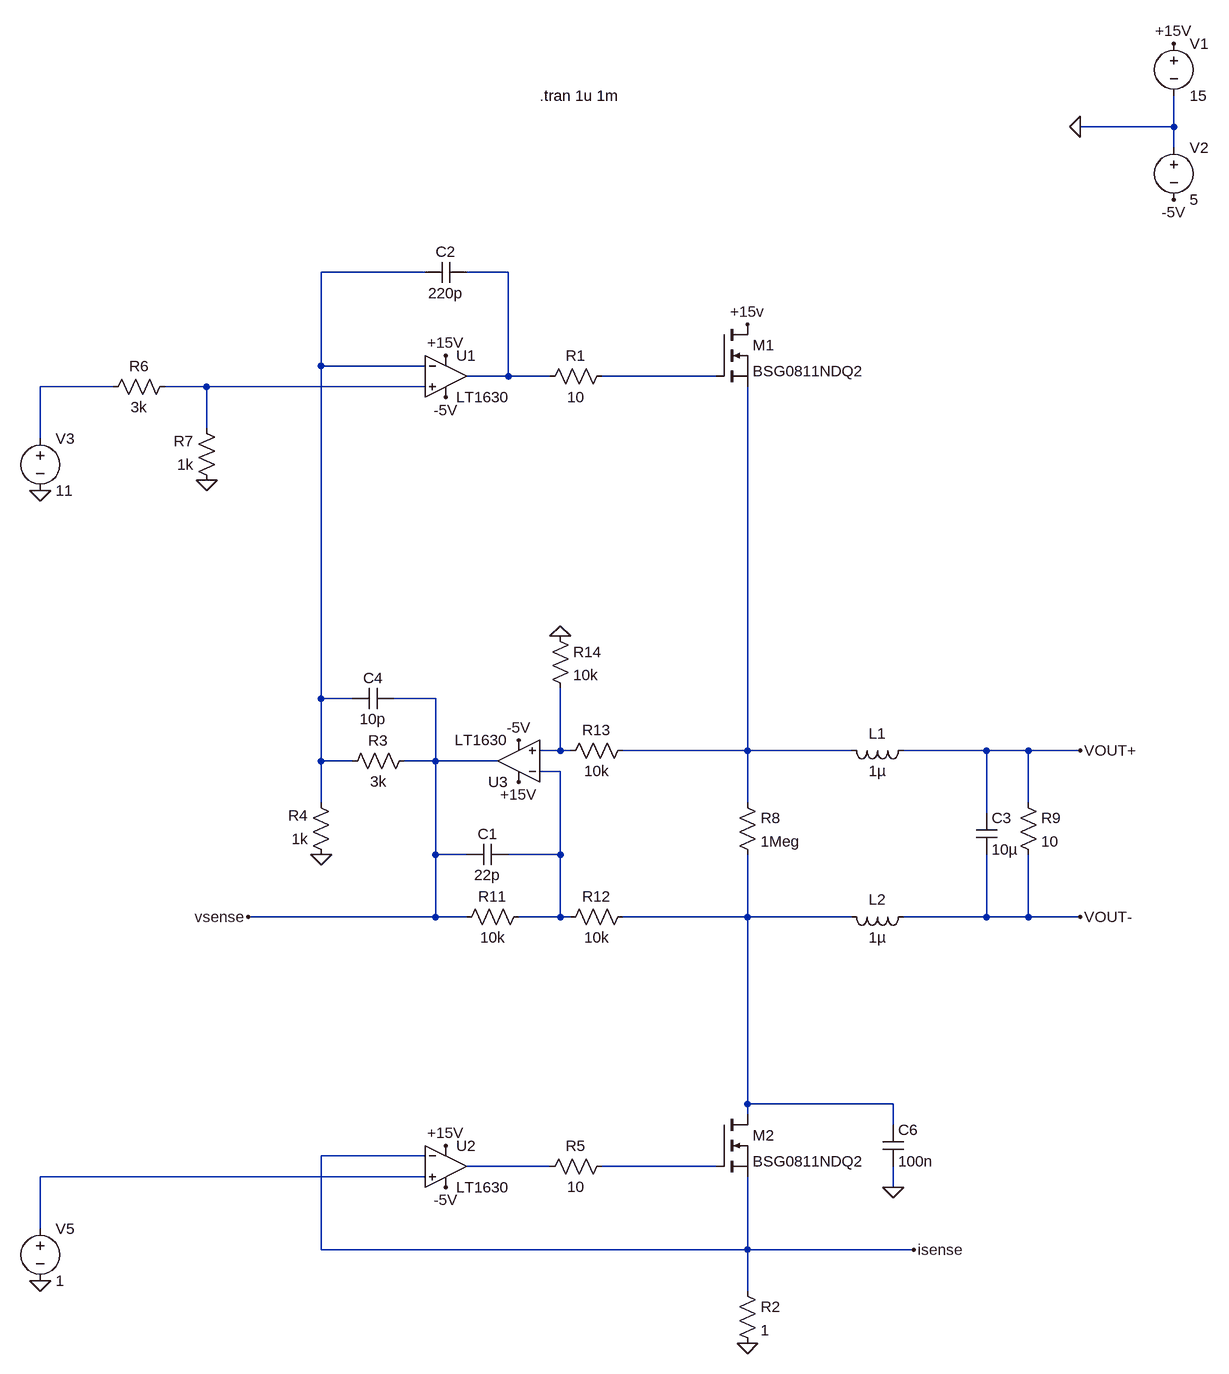
[diagram p0: schematic sim.asc]
sim.asc, the LTspice schematic file:
Version 4
SHEET 1 2592 2176
WIRE 1456 -688 1456 -736
WIRE 1456 -688 1312 -688
WIRE 1456 -656 1456 -688
WIRE 304 -464 144 -464
WIRE 432 -464 368 -464
WIRE 144 -320 144 -464
WIRE 304 -320 144 -320
WIRE 432 -304 432 -464
WIRE 432 -304 368 -304
WIRE 496 -304 432 -304
WIRE 752 -304 576 -304
WIRE -176 -288 -288 -288
WIRE -32 -288 -96 -288
WIRE 304 -288 -32 -288
WIRE -32 -224 -32 -288
WIRE -288 -208 -288 -288
WIRE 144 192 144 -320
WIRE 192 192 144 192
WIRE 320 192 256 192
WIRE 512 272 512 176
WIRE 512 272 480 272
WIRE 528 272 512 272
WIRE 800 272 800 -288
WIRE 800 272 608 272
WIRE 960 272 800 272
WIRE 1168 272 1040 272
WIRE 1232 272 1168 272
WIRE 1312 272 1232 272
WIRE 144 288 144 192
WIRE 192 288 144 288
WIRE 320 288 320 192
WIRE 320 288 272 288
WIRE 416 288 320 288
WIRE 512 304 480 304
WIRE 144 352 144 288
WIRE 800 352 800 272
WIRE 1232 352 1232 272
WIRE 1168 368 1168 272
WIRE 320 432 320 288
WIRE 368 432 320 432
WIRE 512 432 512 304
WIRE 512 432 432 432
WIRE 320 528 320 432
WIRE 320 528 32 528
WIRE 368 528 320 528
WIRE 512 528 512 432
WIRE 512 528 448 528
WIRE 528 528 512 528
WIRE 800 528 800 432
WIRE 800 528 608 528
WIRE 960 528 800 528
WIRE 1168 528 1168 432
WIRE 1168 528 1040 528
WIRE 1232 528 1232 432
WIRE 1232 528 1168 528
WIRE 1312 528 1232 528
WIRE 800 816 800 528
WIRE 1024 816 800 816
WIRE 800 832 800 816
WIRE 1024 848 1024 816
WIRE 304 896 144 896
WIRE 496 912 368 912
WIRE 752 912 576 912
WIRE 304 928 -288 928
WIRE 1024 944 1024 912
WIRE -288 1008 -288 928
WIRE 144 1040 144 896
WIRE 800 1040 800 928
WIRE 800 1040 144 1040
WIRE 1056 1040 800 1040
WIRE 800 1104 800 1040
FLAG 1456 -816 +15V
FLAG 1456 -576 -5V
FLAG 1312 -688 0
FLAG 1312 272 VOUT+
FLAG 1312 528 VOUT-
FLAG 448 256 -5V
FLAG 448 320 +15V
FLAG 512 96 0
FLAG 336 -272 -5V
FLAG 336 -336 +15V
FLAG 800 -384 +15v
FLAG -288 -128 0
FLAG 144 432 0
FLAG 336 944 -5V
FLAG 336 880 +15V
FLAG -288 1088 0
FLAG 800 1184 0
FLAG 1024 944 0
FLAG -32 -144 0
FLAG 1056 1040 isense
FLAG 32 528 vsense
SYMBOL voltage 1456 -832 R0
SYMATTR InstName V1
SYMATTR Value 15
SYMBOL voltage 1456 -672 R0
SYMATTR InstName V2
SYMATTR Value 5
SYMBOL res 1216 336 R0
SYMATTR InstName R9
SYMATTR Value 10
SYMBOL res 464 512 R90
WINDOW 0 0 56 VBottom 2
WINDOW 3 32 56 VTop 2
SYMATTR InstName R11
SYMATTR Value 10k
SYMBOL res 624 512 R90
WINDOW 0 0 56 VBottom 2
WINDOW 3 32 56 VTop 2
SYMATTR InstName R12
SYMATTR Value 10k
SYMBOL res 624 256 R90
WINDOW 0 0 56 VBottom 2
WINDOW 3 32 56 VTop 2
SYMATTR InstName R13
SYMATTR Value 10k
SYMBOL res 496 80 R0
SYMATTR InstName R14
SYMATTR Value 10k
SYMBOL OpAmps/LT1630 448 352 R180
SYMATTR InstName U3
SYMBOL cap 368 448 R270
WINDOW 0 32 32 VTop 2
WINDOW 3 0 32 VBottom 2
SYMATTR InstName C1
SYMATTR Value 22p
SYMBOL OpAmps/LT1630 336 -368 R0
SYMATTR InstName U1
SYMBOL res 592 -320 R90
WINDOW 0 0 56 VBottom 2
WINDOW 3 32 56 VTop 2
SYMATTR InstName R1
SYMATTR Value 10
SYMBOL nmos 752 -384 R0
SYMATTR InstName M1
SYMATTR Value BSG0811NDQ2
SYMBOL voltage -288 -224 R0
SYMATTR InstName V3
SYMATTR Value 11
SYMBOL cap 368 -480 R90
WINDOW 0 0 32 VBottom 2
WINDOW 3 32 32 VTop 2
SYMATTR InstName C2
SYMATTR Value 220p
SYMBOL res 288 272 R90
WINDOW 0 0 56 VBottom 2
WINDOW 3 32 56 VTop 2
SYMATTR InstName R3
SYMATTR Value 3k
SYMBOL res 160 448 R180
WINDOW 0 36 76 Left 2
WINDOW 3 36 40 Left 2
SYMATTR InstName R4
SYMATTR Value 1k
SYMBOL cap 256 176 R90
WINDOW 0 0 32 VBottom 2
WINDOW 3 32 32 VTop 2
SYMATTR InstName C4
SYMATTR Value 10p
SYMBOL res 784 1088 R0
SYMATTR InstName R2
SYMATTR Value 1
SYMBOL OpAmps/LT1630 336 848 R0
SYMATTR InstName U2
SYMBOL res 592 896 R90
WINDOW 0 0 56 VBottom 2
WINDOW 3 32 56 VTop 2
SYMATTR InstName R5
SYMATTR Value 10
SYMBOL nmos 752 832 R0
SYMATTR InstName M2
SYMATTR Value BSG0811NDQ2
SYMBOL voltage -288 992 R0
SYMATTR InstName V5
SYMATTR Value 1
SYMBOL cap 1008 848 R0
SYMATTR InstName C6
SYMATTR Value 100n
SYMBOL res -80 -304 R90
WINDOW 0 0 56 VBottom 2
WINDOW 3 32 56 VTop 2
SYMATTR InstName R6
SYMATTR Value 3k
SYMBOL res -16 -128 R180
WINDOW 0 36 76 Left 2
WINDOW 3 36 40 Left 2
SYMATTR InstName R7
SYMATTR Value 1k
SYMBOL res 784 336 R0
SYMATTR InstName R8
SYMATTR Value 1Meg
SYMBOL cap 1152 368 R0
SYMATTR InstName C3
SYMATTR Value 10µ
SYMBOL ind 1056 256 R90
WINDOW 0 5 56 VBottom 2
WINDOW 3 32 56 VTop 2
SYMATTR InstName L1
SYMATTR Value 1µ
SYMBOL ind 1056 512 R90
WINDOW 0 5 56 VBottom 2
WINDOW 3 32 56 VTop 2
SYMATTR InstName L2
SYMATTR Value 1µ
TEXT 480 -736 Left 2 !.tran 1u 1m

The netlist it stands for:
* sim.asc
V1 +15V 0 15
V2 0 -5V 5
R9 VOUT+ VOUT- 10
R11 N008 vsense 10k
R12 N009 N008 10k
R13 N007 N006 10k
R14 0 N006 10k
XU3 N006 N008 +15V -5V vsense LT1630  ; pins In+ In- V+ V- OUT
C1 vsense N008 22p
XU1 N005 N001 +15V -5V N002 LT1630  ; pins In+ In- V+ V- OUT
R1 N003 N002 10
M1 +15V N003 N007 N007 BSG0811NDQ2
V3 N004 0 11
C2 N002 N001 220p
R3 vsense N001 3k
R4 0 N001 1k
C4 vsense N001 10p
R2 isense 0 1
XU2 N012 isense +15V -5V N010 LT1630  ; pins In+ In- V+ V- OUT
R5 N011 N010 10
M2 N009 N011 isense isense BSG0811NDQ2
V5 N012 0 1
C6 N009 0 100n
R6 N005 N004 3k
R7 0 N005 1k
R8 N007 N009 1Meg
C3 VOUT+ VOUT- 10µ
L1 VOUT+ N007 1µ
L2 VOUT- N009 1µ
.model NMOS NMOS
.model PMOS PMOS
.lib standard.mos
.tran 1u 1m
.backanno
.end